# Altium schematic sheet [7]-Interface_RS232.SchDoc
size A4
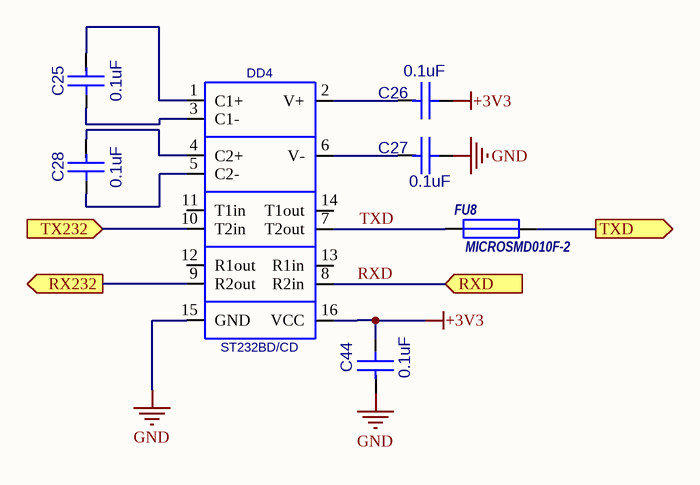
[diagram p0: [7]-Interface_RS232.SchDoc]

## Parts
C25  0.1uF  [CC0603]
C26  0.1uF  [CC0603]
C27  0.1uF  [CC0603]
C28  0.1uF  [CC0603]
C44  0.1uF  [CC0603]
DD4  ST232BD/CD  [SO16_M]
FU8  MICROSMD010F-2  [RC1210]

## Ports
RX232 (out), RXD (in), TX232 (in), TXD (out)

## Nets
+3V3: C26.1(A) C44.1(A) DD4.16(VCC)
GND: C27.1(A) C44.2(B) DD4.15(GND)
RX232: DD4.9(R2out) ; port RX232
RXD: DD4.8(R2in) ; port RXD
TX232: DD4.10(T2in) ; port TX232
TXD: DD4.7(T2out) FU8.1
TXD: FU8.2 ; port TXD  [a separate net that carries the same name]
NetC25_1: C25.1(A) DD4.3(C1-)
NetC25_2: C25.2(B) DD4.1(C1+)
NetC26_2: C26.2(B) DD4.2(V+)
NetC27_2: C27.2(B) DD4.6(V-)
NetC28_1: C28.1(A) DD4.5(C2-)
NetC28_2: C28.2(B) DD4.4(C2+)

Not connected (* = marked no-connect by the designer): DD4 11(T1in) 12(R1out) 13(R1in) 14(T1out)

## Library data of the parts
C25-C28 C44 = CC0603: Value: 0.1uF
FU8 = MICROSMD: Value: MICROSMD010F-2
DD4 = ST232BD/CD: Value: *